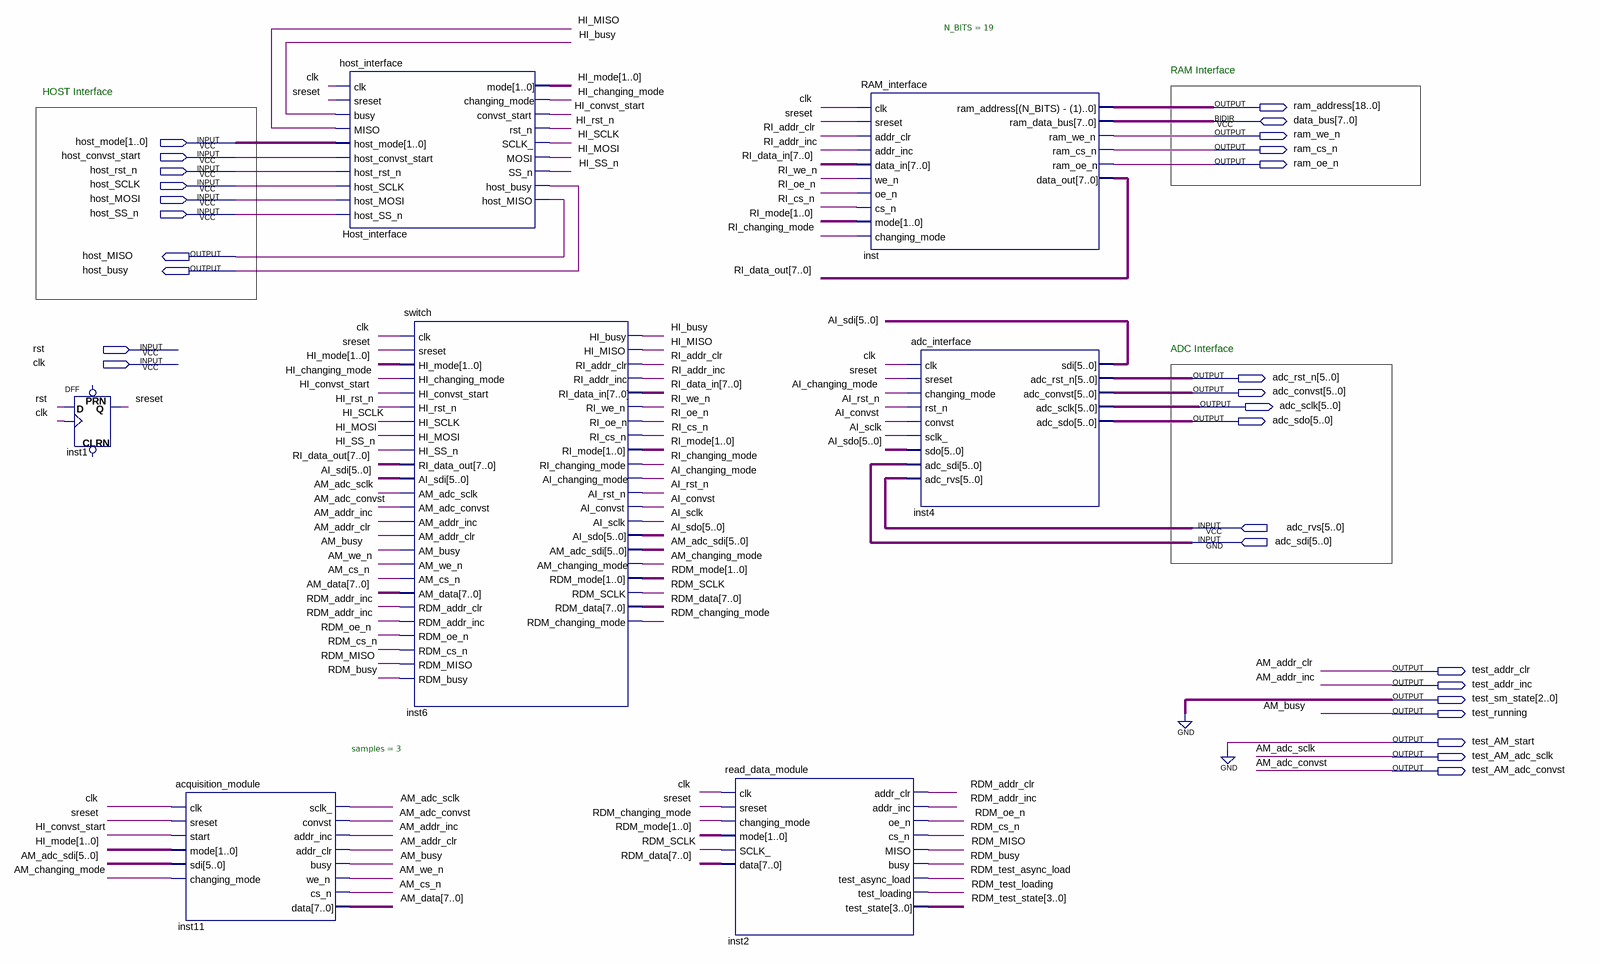
[diagram p0: schematic sheet]
// Quartus schematic sensor_buchas_CPLD.bdf as structural Verilog: 7 symbols, 28 pins
module sensor_buchas_CPLD (
  input  [1:0] host_mode,
  input  host_convst_start,
  input  host_rst_n,
  input  host_SCLK,
  input  host_MOSI,
  input  host_SS_n,
  input  rst,
  input  clk,
  input  [5:0] adc_rvs,
  input  [5:0] adc_sdi,
  inout  [7:0] data_bus,
  output [18:0] ram_address,
  output ram_we_n,
  output ram_cs_n,
  output ram_oe_n,
  output host_MISO,
  output host_busy,
  output [5:0] adc_rst_n,
  output [5:0] adc_convst,
  output [5:0] adc_sclk,
  output [5:0] adc_sdo,
  output test_addr_clr,
  output test_addr_inc,
  output [2:0] test_sm_state,
  output test_running,
  output test_AM_start,
  output test_AM_adc_sclk,
  output test_AM_adc_convst
);

  wire AI_changing_mode, AI_convst, AI_rst_n, AI_sclk, AM_changing_mode, AM_cs_n, AM_we_n, HI_busy,
       HI_changing_mode, HI_convst_start, HI_MISO, HI_MOSI, HI_rst_n, HI_SCLK, HI_SS_n, RDM_addr_clr,
       RDM_addr_inc, RDM_busy, RDM_changing_mode, RDM_cs_n, RDM_MISO, RDM_oe_n, RDM_SCLK,
       RDM_test_async_load, RDM_test_loading, RI_addr_clr, RI_addr_inc, RI_changing_mode, RI_cs_n, RI_oe_n,
       RI_we_n, sreset;
  wire [1:0] HI_mode, RDM_mode, RI_mode;
  wire [3:0] RDM_test_state;
  wire [5:0] AI_sdi, AI_sdo, AM_adc_sdi;
  wire [7:0] AM_data, RDM_data, RI_data_in, RI_data_out;

  DFF inst1 (.CLK(clk), .D(rst), .Q(sreset));  // open: CLRN, PRN
  acquisition_module #(.samples(3)) inst11 (
    .clk(clk), .sreset(sreset), .start(HI_convst_start), .mode(HI_mode), .sdi(AM_adc_sdi),
    .changing_mode(AM_changing_mode), .sclk_(test_AM_adc_sclk), .convst(test_AM_adc_convst),
    .addr_inc(test_addr_inc), .addr_clr(test_addr_clr), .busy(test_running), .we_n(AM_we_n), .cs_n(AM_cs_n),
    .data(AM_data));
  host_interface Host_interface (
    .clk(clk), .sreset(sreset), .busy(HI_busy), .MISO(HI_MISO), .host_mode(host_mode),
    .host_convst_start(host_convst_start), .host_rst_n(host_rst_n), .host_SCLK(host_SCLK),
    .host_MOSI(host_MOSI), .host_SS_n(host_SS_n), .mode(HI_mode), .changing_mode(HI_changing_mode),
    .convst_start(HI_convst_start), .rst_n(HI_rst_n), .SCLK_(HI_SCLK), .MOSI(HI_MOSI), .SS_n(HI_SS_n),
    .host_busy(host_busy), .host_MISO(host_MISO));
  switch inst6 (
    .clk(clk), .sreset(sreset), .HI_mode(HI_mode), .HI_changing_mode(HI_changing_mode),
    .HI_convst_start(HI_convst_start), .HI_rst_n(HI_rst_n), .HI_SCLK(HI_SCLK), .HI_MOSI(HI_MOSI),
    .HI_SS_n(HI_SS_n), .RI_data_out(RI_data_out), .AI_sdi(AI_sdi), .AM_adc_sclk(test_AM_adc_sclk),
    .AM_adc_convst(test_AM_adc_convst), .AM_addr_inc(test_addr_inc), .AM_addr_clr(test_addr_clr),
    .AM_busy(test_running), .AM_we_n(AM_we_n), .AM_cs_n(AM_cs_n), .AM_data(AM_data),
    .RDM_addr_clr(RDM_addr_inc), .RDM_addr_inc(RDM_addr_inc), .RDM_oe_n(RDM_oe_n), .RDM_cs_n(RDM_cs_n),
    .RDM_MISO(RDM_MISO), .RDM_busy(RDM_busy), .HI_busy(HI_busy), .HI_MISO(HI_MISO),
    .RI_addr_clr(RI_addr_clr), .RI_addr_inc(RI_addr_inc), .RI_data_in(RI_data_in), .RI_we_n(RI_we_n),
    .RI_oe_n(RI_oe_n), .RI_cs_n(RI_cs_n), .RI_mode(RI_mode), .RI_changing_mode(RI_changing_mode),
    .AI_changing_mode(AI_changing_mode), .AI_rst_n(AI_rst_n), .AI_convst(AI_convst), .AI_sclk(AI_sclk),
    .AI_sdo(AI_sdo), .AM_adc_sdi(AM_adc_sdi), .AM_changing_mode(AM_changing_mode), .RDM_mode(RDM_mode),
    .RDM_SCLK(RDM_SCLK), .RDM_data(RDM_data), .RDM_changing_mode(RDM_changing_mode));
  read_data_module inst2 (
    .clk(clk), .sreset(sreset), .changing_mode(RDM_changing_mode), .mode(RDM_mode), .SCLK_(RDM_SCLK),
    .data(RDM_data), .addr_clr(RDM_addr_clr), .addr_inc(RDM_addr_inc), .oe_n(RDM_oe_n), .cs_n(RDM_cs_n),
    .MISO(RDM_MISO), .busy(RDM_busy), .test_async_load(RDM_test_async_load), .test_loading(RDM_test_loading),
    .test_state(RDM_test_state));
  RAM_interface #(.N_BITS(19)) inst (
    .clk(clk), .sreset(sreset), .addr_clr(RI_addr_clr), .addr_inc(RI_addr_inc), .data_in(RI_data_in),
    .we_n(RI_we_n), .oe_n(RI_oe_n), .cs_n(RI_cs_n), .mode(RI_mode), .changing_mode(RI_changing_mode),
    .ram_address(ram_address), .ram_we_n(ram_we_n), .ram_cs_n(ram_cs_n), .ram_oe_n(ram_oe_n),
    .data_out(RI_data_out), .ram_data_bus(data_bus));
  adc_interface inst4 (
    .clk(clk), .sreset(sreset), .changing_mode(AI_changing_mode), .rst_n(AI_rst_n), .convst(AI_convst),
    .sclk_(AI_sclk), .sdo(AI_sdo), .adc_sdi(adc_sdi), .adc_rvs(adc_rvs), .sdi(AI_sdi), .adc_rst_n(adc_rst_n),
    .adc_convst(adc_convst), .adc_sclk(adc_sclk), .adc_sdo(adc_sdo));

  assign test_AM_start = 1'b0;
  assign test_sm_state = 3'b000;

  // Other names for the same wires on the sheet: AM_adc_convst = test_AM_adc_convst; AM_adc_sclk = test_AM_adc_sclk;
  //   AM_addr_clr = test_addr_clr; AM_addr_inc = test_addr_inc; AM_busy = test_running

  // Notes on the sheet:
  //   RAM Interface
  //   HOST Interface
  //   ADC Interface
endmodule
